# EasyEDA schematic Schematic_63S8_(V1.5)_2026-08-04.json
TITLE: 53S8 Hexadecimal Keypad; REV: 1.5; Sheet: 1/1; Drawn By: Rumidom
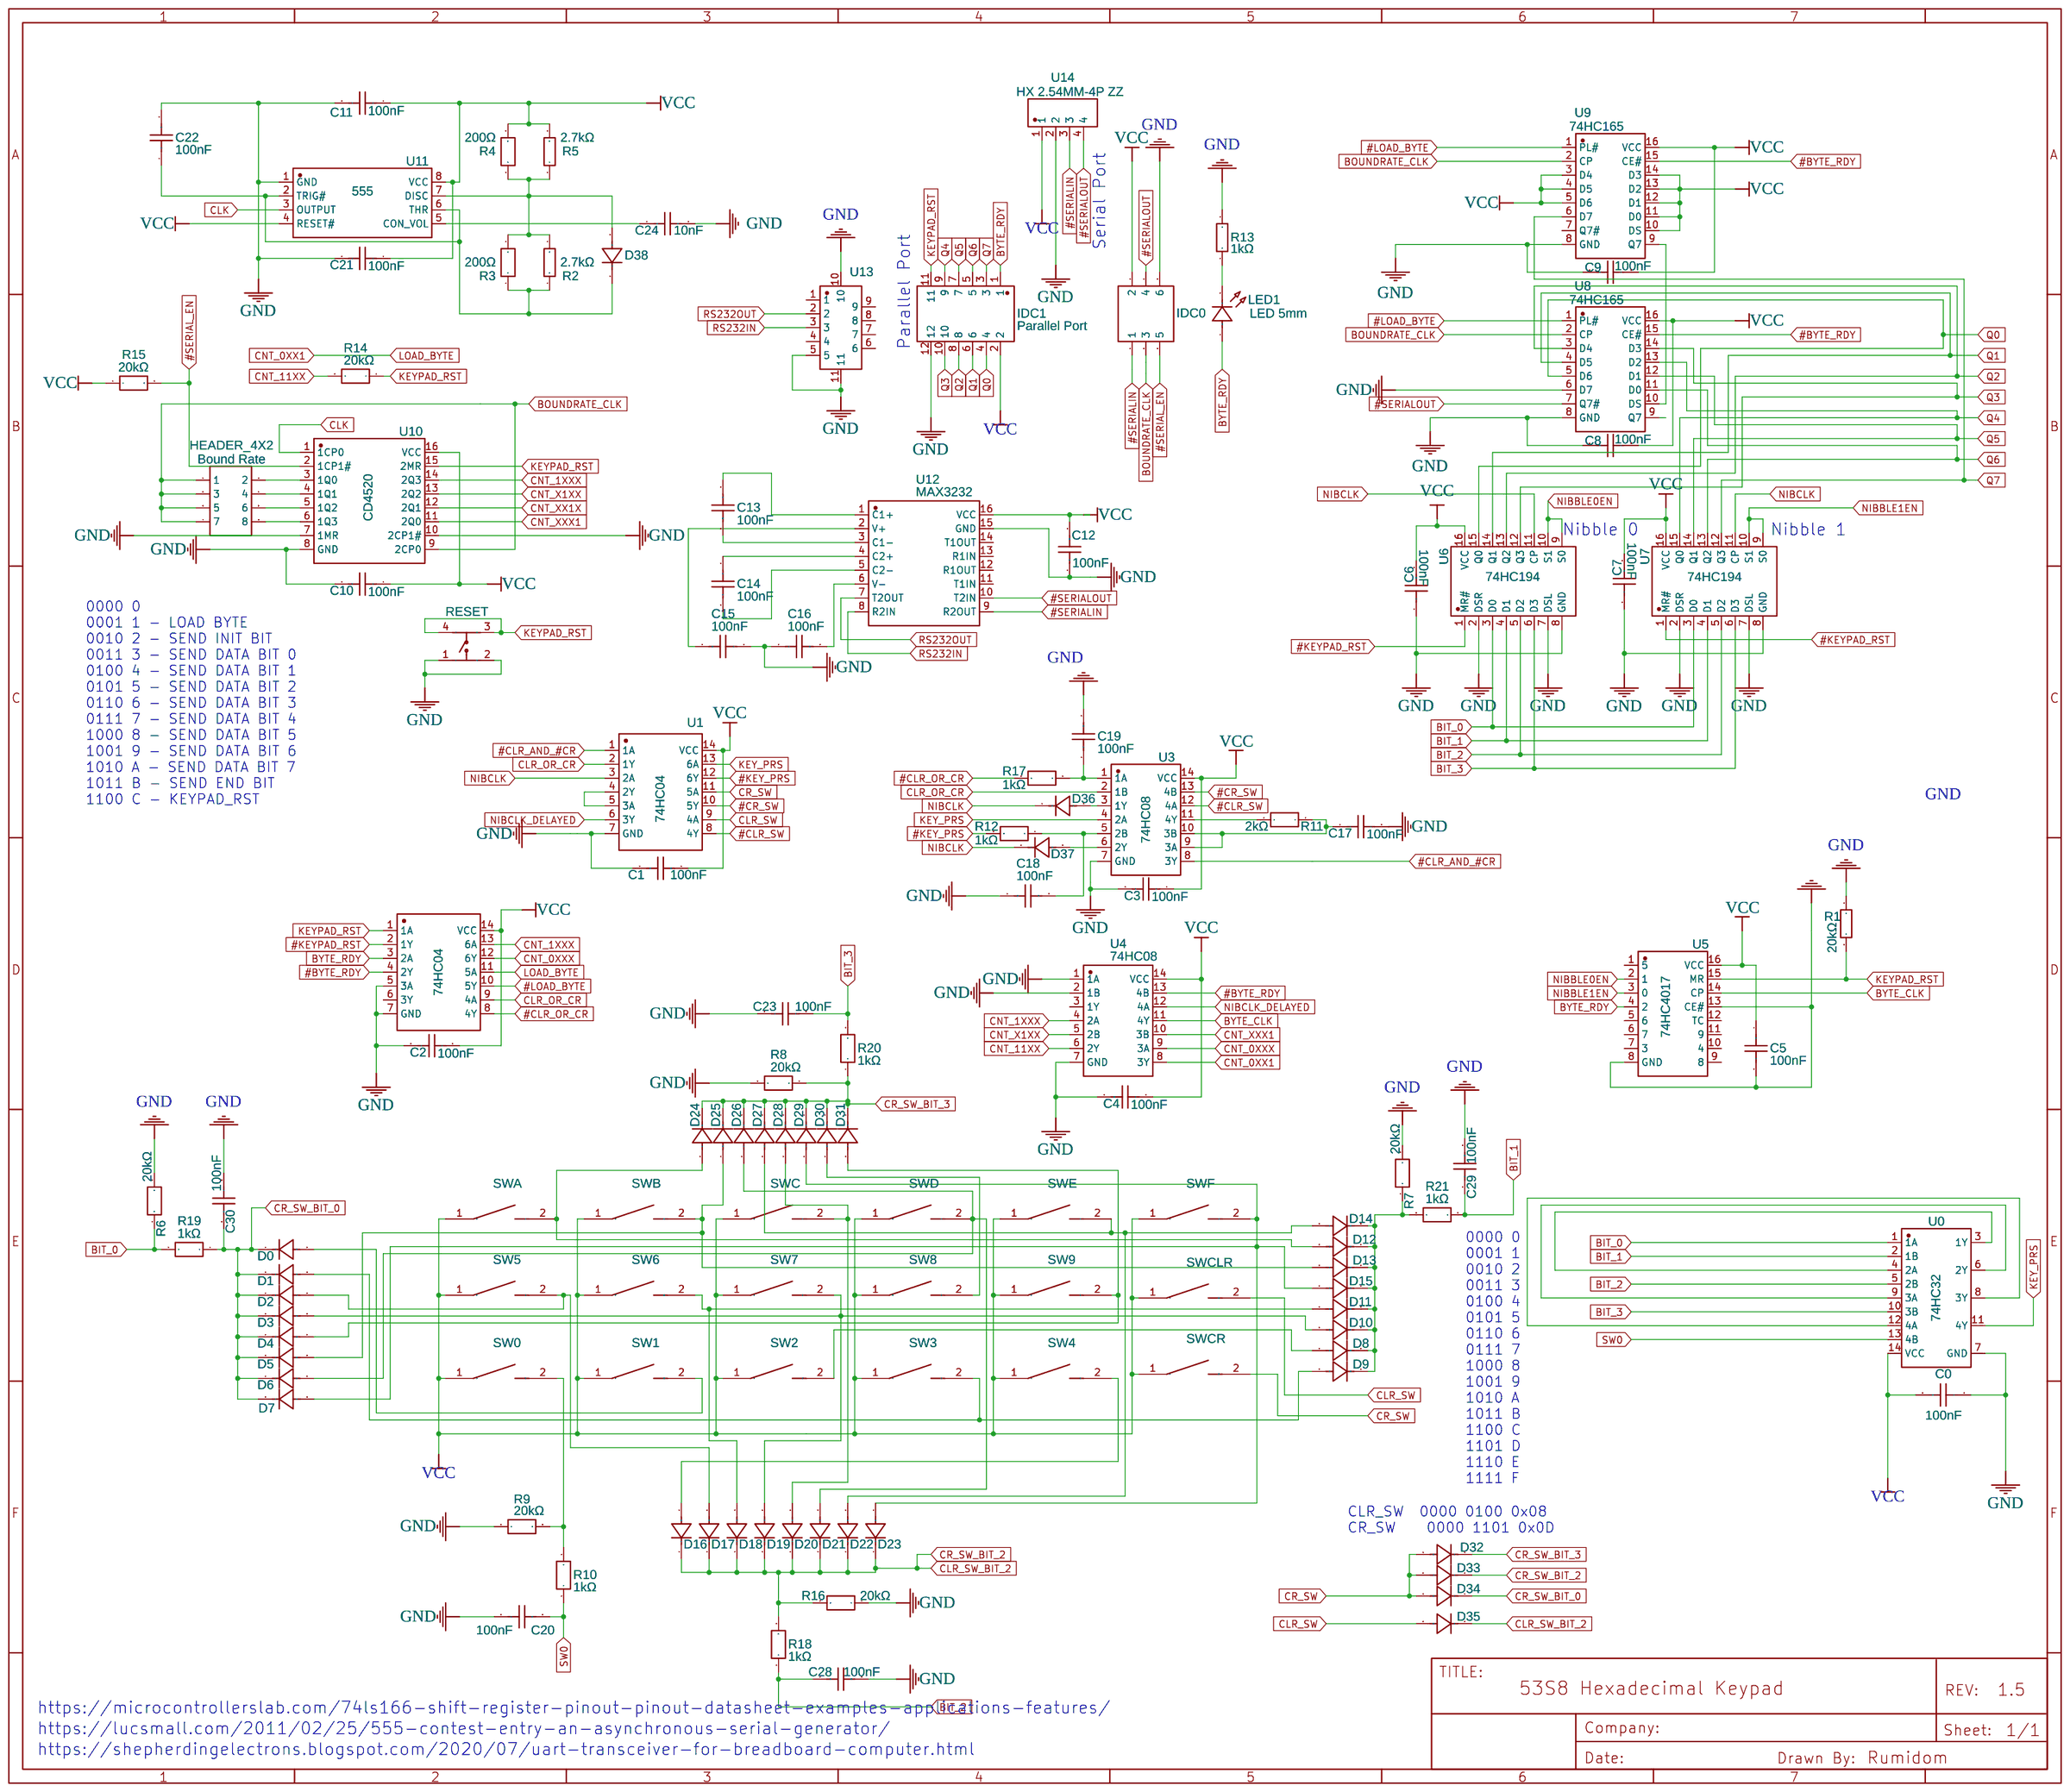
[diagram p0: schematic sheet]

## Parts
C0  100nF  [C0603]
C1  100nF  [C0603]
C2  100nF  [C0603]
C3  100nF  [C0603]
C4  100nF  [C0603]
C5  100nF  [C0603]
C6  100nF  [C0603]
C7  100nF  [C0603]
C8  100nF  [C0603]
C9  100nF  [C0603]
C10  100nF  [C0603]
C11  100nF  [C0603]
C12  100nF  [C0603]
C13  100nF  [C0603]
C14  100nF  [C0603]
C15  100nF  [C0603]
C16  100nF  [C0603]
C17  100nF  [C0603]
C18  100nF  [C0603]
C19  100nF  [C0603]
C20  100nF  [C0603]
C21  100nF  [C0603]
C22  100nF  [C0603]
C23  100nF  [C0603]
C24  10nF  [C0603]
C28  100nF  [C0603]
C29  100nF  [C0603]
C30  100nF  [C0603]
D0  JAN1N4148UR-1  [DO-213AA_L3.5-W1.5-RD]
D1  JAN1N4148UR-1  [DO-213AA_L3.5-W1.5-RD]
D2  JAN1N4148UR-1  [DO-213AA_L3.5-W1.5-RD]
D3  JAN1N4148UR-1  [DO-213AA_L3.5-W1.5-RD]
D4  JAN1N4148UR-1  [DO-213AA_L3.5-W1.5-RD]
D5  JAN1N4148UR-1  [DO-213AA_L3.5-W1.5-RD]
D6  JAN1N4148UR-1  [DO-213AA_L3.5-W1.5-RD]
D7  JAN1N4148UR-1  [DO-213AA_L3.5-W1.5-RD]
D8  JAN1N4148UR-1  [DO-213AA_L3.5-W1.5-RD]
D9  JAN1N4148UR-1  [DO-213AA_L3.5-W1.5-RD]
D10  JAN1N4148UR-1  [DO-213AA_L3.5-W1.5-RD]
D11  JAN1N4148UR-1  [DO-213AA_L3.5-W1.5-RD]
D12  JAN1N4148UR-1  [DO-213AA_L3.5-W1.5-RD]
D13  JAN1N4148UR-1  [DO-213AA_L3.5-W1.5-RD]
D14  JAN1N4148UR-1  [DO-213AA_L3.5-W1.5-RD]
D15  JAN1N4148UR-1  [DO-213AA_L3.5-W1.5-RD]
D16  JAN1N4148UR-1  [DO-213AA_L3.5-W1.5-RD]
D17  JAN1N4148UR-1  [DO-213AA_L3.5-W1.5-RD]
D18  JAN1N4148UR-1  [DO-213AA_L3.5-W1.5-RD]
D19  JAN1N4148UR-1  [DO-213AA_L3.5-W1.5-RD]
D20  JAN1N4148UR-1  [DO-213AA_L3.5-W1.5-RD]
D21  JAN1N4148UR-1  [DO-213AA_L3.5-W1.5-RD]
D22  JAN1N4148UR-1  [DO-213AA_L3.5-W1.5-RD]
D23  JAN1N4148UR-1  [DO-213AA_L3.5-W1.5-RD]
D24  JAN1N4148UR-1  [DO-213AA_L3.5-W1.5-RD]
D25  JAN1N4148UR-1  [DO-213AA_L3.5-W1.5-RD]
D26  JAN1N4148UR-1  [DO-213AA_L3.5-W1.5-RD]
D27  JAN1N4148UR-1  [DO-213AA_L3.5-W1.5-RD]
D28  JAN1N4148UR-1  [DO-213AA_L3.5-W1.5-RD]
D29  JAN1N4148UR-1  [DO-213AA_L3.5-W1.5-RD]
D30  JAN1N4148UR-1  [DO-213AA_L3.5-W1.5-RD]
D31  JAN1N4148UR-1  [DO-213AA_L3.5-W1.5-RD]
D32  JAN1N4148UR-1  [DO-213AA_L3.5-W1.5-RD]
D33  JAN1N4148UR-1  [DO-213AA_L3.5-W1.5-RD]
D34  JAN1N4148UR-1  [DO-213AA_L3.5-W1.5-RD]
D35  JAN1N4148UR-1  [DO-213AA_L3.5-W1.5-RD]
D36  JAN1N4148UR-1  [DO-213AA_L3.5-W1.5-RD]
D37  JAN1N4148UR-1  [DO-213AA_L3.5-W1.5-RD]
D38  JAN1N4148UR-1  [DO-213AA_L3.5-W1.5-RD]
HEADER_4X2  Bound Rate  [HEADER 4X2]
IDC0  Serial Port  [IDC-TH_6P-P2.54_C11214]
IDC1  Parallel Port  [IDC-TH_12P-P2.54-V-M-R2-C6-LS2.54]
LED1  LED 5mm  [LED-5MM-5MM]
R1  20kΩ  [R0603]
R2  2.7kΩ  [R0603]
R3  200Ω  [R0603]
R4  200Ω  [R0603]
R5  2.7kΩ  [R0603]
R6  20kΩ  [R0603]
R7  20kΩ  [R0603]
R8  20kΩ  [R0603]
R9  20kΩ  [R0603]
R10  1kΩ  [R0603]
R11  2kΩ  [R0603]
R12  1kΩ  [R0603]
R13  1kΩ  [R0603]
R14  20kΩ  [R0603]
R15  20kΩ  [R0603]
R16  20kΩ  [R0603]
R17  1kΩ  [R0603]
R18  1kΩ  [R0603]
R19  1kΩ  [R0603]
R20  1kΩ  [R0603]
R21  1kΩ  [R0603]
RESET  button6*6*8  [KEY-TH_4P-L6.0-W6.0-P4.50-LS7.5]
SW0  Cherry_SW  [CHERRY MX]
SW1  Cherry_SW  [CHERRY MX]
SW2  Cherry_SW  [CHERRY MX]
SW3  Cherry_SW  [CHERRY MX]
SW4  Cherry_SW  [CHERRY MX]
SW5  Cherry_SW  [CHERRY MX]
SW6  Cherry_SW  [CHERRY MX]
SW7  Cherry_SW  [CHERRY MX]
SW8  Cherry_SW  [CHERRY MX]
SW9  Cherry_SW  [CHERRY MX]
SWA  Cherry_SW  [CHERRY MX]
SWB  Cherry_SW  [CHERRY MX]
SWC  Cherry_SW  [CHERRY MX]
SWCLR  Cherry_SW  [CHERRY MX]
SWCR  Cherry_SW  [CHERRY MX]
SWD  Cherry_SW  [CHERRY MX]
SWE  Cherry_SW  [CHERRY MX]
SWF  Cherry_SW  [CHERRY MX]
U0  74HC32  [SOIC-16_L10.8-W4.5-P1.27-LS6.8-BL]
U1  74HC04  [SOIC-16_L10.8-W4.5-P1.27-LS6.8-BL]
U2  74HC04  [SOIC-16_L10.8-W4.5-P1.27-LS6.8-BL]
U3  74HC08  [SOIC-16_L10.8-W4.5-P1.27-LS6.8-BL]
U4  74HC08  [SOIC-16_L10.8-W4.5-P1.27-LS6.8-BL]
U5  74HC4017  [SOIC-16_L10.8-W4.5-P1.27-LS6.8-BL]
U6  74HC194  [SOIC-16_L10.8-W4.5-P1.27-LS6.8-BL]
U7  74HC194  [SOIC-16_L10.8-W4.5-P1.27-LS6.8-BL]
U8  74HC165  [SOP-16_L9.9-W3.9-P1.27-LS6.1-BL]
U9  74HC165  [SOP-16_L9.9-W3.9-P1.27-LS6.1-BL]
U10  CD4520  [SOIC-16_L10.8-W4.5-P1.27-LS6.8-BL]
U11  555  [SOP-8_L4.9-W3.8-P1.27-LS6.0-BL]
U12  MAX3232  [SOIC-16_L10.8-W4.5-P1.27-LS6.8-BL]
U13  DB9 RS232  [DB9-TH_DB9FEMALE_C9900003585]
U14  HX 2.54MM-4P ZZ  [CONN-TH_4P-P2.50_HX-2.54MM-4P-ZZ-MS]

## Library data of the parts
C0-C21 C23 C28-C30 = GRM188R72A104KA35J_C3011705: Supplier: LCSC; Supplier Part: C3011705; Manufacturer: muRata(村田); Manufacturer Part: GRM188R72A104KA35J; JLCPCB Part Class: Extended Part; Contributor: lcsc
C22 C24 = C1608X7R1H103K/10: Supplier: LCSC; Supplier Part: C19340180; Manufacturer: TDK; JLCPCB Part Class: Extended Part; Contributor: lcsc
D0-D38 = JAN1N4148UR-1: Supplier: LCSC; Supplier Part: C2831794; Manufacturer: MICROCHIP(美国微芯); JLCPCB Part Class: Extended Part; Contributor: lcsc
HEADER_4X2 = HEADER_4x2: Contributor: i3dbee
IDC0 = HDR-IDC-2.54-2X3P: Supplier: LCSC; Manufacturer: BOOMELE(博穆精密); Manufacturer Part: 2.54-2*3P简牛; Supplier Part: C11214; JLCPCB Part Class: Extended Part
IDC1 = BH254V-12P: Supplier: LCSC; Supplier Part: C48687626; Manufacturer: XFCN(兴飞); JLCPCB Part Class: Extended Part; Contributor: lcsc
LED1 = LED 5mm: Supplier: LCSC; Supplier Part: C605466; Manufacturer: Everlight Elec; Manufacturer Part: 264-7ID; Contributor: ahmad_agus; JLCPCB Part Class: Extended Part
R1 = ARG03BTC2002: Contributor: LCSC; Supplier: LCSC; Supplier Part: C335084; Manufacturer: Viking(光颉); JLCPCB Part Class: Extended Part
R2 R5 = RMC06032.7K1%N: Contributor: LCSC; Supplier: LCSC; Supplier Part: C325595; Manufacturer: Tyohm(幸亚电阻); JLCPCB Part Class: Extended Part
R3 R4 = CRCW0603200RFKEAHP: Supplier: LCSC; Supplier Part: C313701; Manufacturer: VISHAY(威世); JLCPCB Part Class: Extended Part; Contributor: lcsc
R6-R9 R11 R12 R14-R17 = AT0603BRE0720KL: Supplier: LCSC; Supplier Part: C6126568; Manufacturer: YAGEO(国巨); JLCPCB Part Class: Extended Part; Contributor: lcsc
R10 R18-R21 = 0603 ±5% 1K: Contributor: LCSC; Supplier: LCSC; Supplier Part: C2889391; Manufacturer: VO(翔胜); JLCPCB Part Class: Extended Part
R13 = 0603WAF1001T5E: Supplier: LCSC; Manufacturer: UNI-ROYAL(厚声); Supplier Part: C21190; JLCPCB Part Class: Basic Part
RESET = button6*6*8: Supplier Part: C59982; Supplier: LCSC; Manufacturer: ReliaPro; JLCPCB Part Class: Extended Part
SW0-SW9 SWA SWB SWC SWCLR SWCR SWD SWE SWF = CHERRY_MX Clone: Manufacturer Part: CHERRY; Contributor: drummdan; Supplier: Reichelt
U0 = 74HCT32D/C118: Supplier: LCSC; Supplier Part: C4470225; Manufacturer: Nexperia(安世); JLCPCB Part Class: Extended Part; Contributor: lcsc
U1 U2 = 74HC04: Supplier: LCSC; Manufacturer: FM(富满); Manufacturer Part: 74HC04D; Supplier Part: C86613; JLCPCB Part Class: Extended Part
U3 U4 = 74HC08D-HX: Supplier: LCSC; Supplier Part: C54784392; Manufacturer: ZHHXDZ(海芯电子); Contributor: lcsc; JLCPCB Part Class: Extended Part
U5 = CD74HC4017MT: Contributor: LCSC; Supplier: LCSC; Supplier Part: C2675446; Manufacturer: TI(德州仪器); JLCPCB Part Class: Extended Part
U6 U7 = CD74HC194M: Contributor: lcsc; Supplier: LCSC; Supplier Part: C3304354; Manufacturer: TI(德州仪器); JLCPCB Part Class: Extended Part
U8 U9 = EM74HC165D: Supplier: LCSC; Supplier Part: C49188286; Manufacturer: EnergyMath(芯祥科技); Contributor: lcsc; JLCPCB Part Class: Extended Part
U10 = 74HC4520D,112: Contributor: LCSC; Supplier: LCSC; Supplier Part: C547069; Manufacturer: Nexperia(安世); JLCPCB Part Class: Extended Part
U11 = LMC555DRG: Supplier: LCSC; Supplier Part: C19723742; Manufacturer: HGC(深圳汉芯); JLCPCB Part Class: Extended Part; Contributor: lcsc
U12 = COSMAX3232ID: Supplier: LCSC; Supplier Part: C18198088; Manufacturer: COSINE(科山芯创); Contributor: lcsc; JLCPCB Part Class: Extended Part
U13 = 2301843-1: Contributor: lcsc; Supplier: LCSC; Supplier Part: C3118153; Manufacturer: TE Connectivity(泰科电子); JLCPCB Part Class: Extended Part
U14 = HX 2.54MM-4P ZZ: Supplier: LCSC; Supplier Part: C7543433; Manufacturer: hanxia(韩下); Manufacturer Part: HX 2.54mm-4P ZZ; Contributor: lcsc; JLCPCB Part Class: Extended Part

## Nets
GND: C0.1 C1.2 C2.2 C3.2 C4.2 C5.2 C6.1 C7.1 C8.2 C9.2 C10.2 C11.2 C12.2 C15.2 C16.1 C17.2 C18.1 C19.2 C20.1 C21.2 C22.2 C23.1 C24.2 C28.2 C29.2 C30.1 IDC0.6 IDC1.12 R1.1 R6.2 R7.2 R8.2 R9.1 R13.2 R16.1 RESET.1 RESET.2 U0.7(GND) U1.7(GND) U2.5(3A) U2.7(GND) U3.7(GND) U4.1(1A) U4.2(1B) U4.7(GND) U5.8(GND) U5.13(CE#) U6.2(DSR) U6.7(DSL) U6.8(GND) U7.2(DSR) U7.7(DSL) U7.8(GND) U8.6(D7) U8.8(GND) U9.8(GND) U10.7(1MR) U10.8(GND) U10.10(2CP1#) U11.1(GND) U12.15(GND) U13.5 U13.10 U13.11 U14.2
VCC: C0.2 C1.1 C2.1 C3.1 C4.1 C5.1 C6.2 C7.2 C8.1 C9.1 C10.1 C11.1 C12.1 C21.1 IDC0.2 IDC1.2 R4.2 R5.2 R15.1 SW0.1 SW1.1 SW2.1 SW3.1 SW4.1 SW5.1 SW6.1 SW7.1 SW8.1 SW9.1 SWA.1 SWB.1 SWC.1 SWCLR.1 SWCR.1 SWD.1 SWE.1 SWF.1 U0.14(VCC) U1.14(VCC) U2.14(VCC) U3.14(VCC) U4.14(VCC) U5.16(VCC) U6.16(VCC) U7.16(VCC) U8.16(VCC) U9.3(D4) U9.4(D5) U9.5(D6) U9.10(DS) U9.11(D0) U9.12(D1) U9.13(D2) U9.14(D3) U9.16(VCC) U10.16(VCC) U11.4(RESET#) U11.8(VCC) U12.16(VCC) U14.1
#BYTE_RDY: U2.4(2Y) U4.13(4B) U8.15(CE#) U9.15(CE#)
#CLR_AND_#CR: U1.1(1A) U3.8(3Y)
#CLR_OR_CR: R17.2 U2.8(4Y)
#CLR_SW: U1.8(4Y) U3.12(4A)
#CR_SW: U1.10(5Y) U3.13(4B)
#KEY_PRS: R12.2 U1.12(6Y)
#KEYPAD_RST: U2.2(1Y) U6.1(MR#) U7.1(MR#)
#LOAD_BYTE: U2.10(5Y) U8.1(PL#) U9.1(PL#)
#SERIAL_EN: IDC0.5 R15.2 U10.2(1CP1#)
#SERIALIN: IDC0.1 U12.9(R2OUT) U14.3
#SERIALOUT: IDC0.4 U8.7(Q7#) U12.10(T2IN) U14.4
BIT_0: R6.1 R19.2 U0.1(1A) U6.3(D0) U7.3(D0)
BIT_1: C29.1 R21.1 U0.2(1B) U6.4(D1) U7.4(D1)
BIT_2: C28.1 R18.1 U0.5(2B) U6.5(D2) U7.5(D2)
BIT_3: C23.2 R20.2 U0.10(3B) U6.6(D3) U7.6(D3)
BOUNDRATE_CLK: HEADER_4X2.1 HEADER_4X2.3 HEADER_4X2.5 HEADER_4X2.7 IDC0.3 U8.2(CP) U9.2(CP) U10.9(2CP0)
BYTE_CLK: U4.11(4Y) U5.14(CP)
BYTE_RDY: IDC1.1 LED1.1(A) U2.3(2A) U5.4(2)
CLK: U10.1(1CP0) U11.3(OUTPUT)
CLR_OR_CR: U1.2(1Y) U2.9(4A) U3.2(1B)
CLR_SW: D35.2(A) SWCLR.2 U1.9(4A)
CLR_SW_BIT_2: D16.1(K) D17.1(K) D18.1(K) D19.1(K) D20.1(K) D21.1(K) D22.1(K) D23.1(K) D33.1(K) D35.1(K) R16.2 R18.2
CNT_0XX1: U2.11(5A) U4.8(3Y)
CNT_0XXX: U2.12(6Y) U4.9(3A)
CNT_1XXX: U2.13(6A) U4.4(2A) U10.14(2Q3)
CNT_11XX: R14.2 U4.6(2Y)
CNT_X1XX: U4.5(2B) U10.13(2Q2)
CNT_XX1X: U10.12(2Q1)
CNT_XXX1: U4.10(3B) U10.11(2Q0)
CR_SW: D32.2(A) D33.2(A) D34.2(A) SWCR.2 U1.11(5A)
CR_SW_BIT_0: C30.2 D0.1(K) D1.1(K) D2.1(K) D3.1(K) D4.1(K) D5.1(K) D6.1(K) D7.1(K) D34.1(K) R19.1
CR_SW_BIT_3: D24.1(K) D25.1(K) D26.1(K) D27.1(K) D28.1(K) D29.1(K) D30.1(K) D31.1(K) D32.1(K) R8.1 R20.1
KEY_PRS: U0.11(4Y) U1.13(6A) U3.4(2A)
KEYPAD_RST: IDC1.11 R1.2 R14.1 RESET.3 RESET.4 U2.1(1A) U5.15(MR) U10.15(2MR)
NIBBLE0EN: U5.2(1) U6.9(S0) U6.10(S1)
NIBBLE1EN: U5.3(0) U7.9(S0) U7.10(S1)
NIBCLK: D36.1(K) D37.1(K) U1.3(2A) U6.11(CP) U7.11(CP)
NIBCLK_DELAYED: U1.6(3Y) U4.12(4A)
Q0: IDC1.4 U6.15(Q0) U8.5(D6)
Q1: IDC1.6 U6.14(Q1) U8.4(D5)
Q2: IDC1.8 U6.13(Q2) U8.3(D4)
Q3: IDC1.10 U6.12(Q3) U8.14(D3)
Q4: IDC1.9 U7.15(Q0) U8.13(D2)
Q5: IDC1.7 U7.14(Q1) U8.12(D1)
Q6: IDC1.5 U7.13(Q2) U8.11(D0)
Q7: IDC1.3 U7.12(Q3) U9.6(D7)
RS232IN: U12.8(R2IN) U13.3
RS232OUT: U12.7(T2OUT) U13.2
SW0: C20.2 R10.1 U0.13(4B)
Net-(C13-1): C13.1 U12.1(C1+)
Net-(C13-2): C13.2 U12.3(C1-)
Net-(C14-1): C14.1 U12.4(C2+)
Net-(C14-2): C14.2 U12.5(C2-)
Net-(C15-1): C15.1 U12.2(V+)
Net-(C16-2): C16.2 U12.6(V-)
Net-(C17-1): C17.1 R11.1 U3.9(3A) U3.10(3B)
Net-(C18-2): C18.2 R12.1 U3.5(2B)
Net-(C19-1): C19.1 R17.1 U3.1(1A)
Net-(C22-1): C22.1 D38.1(K) R2.1 R3.1 U11.2(TRIG#) U11.6(THR)
Net-(C24-1): C24.1 U11.5(CON_VOL)
Net-(D0-2): D0.2(A) SW1.2
Net-(D1-2): D1.2(A) D9.2(A) SW3.2
Net-(D2-2): D2.2(A) D17.2(A) SW5.2
Net-(D3-2): D3.2(A) D10.2(A) D19.2(A) SW7.2
Net-(D4-2): D4.2(A) D31.2(A) SW9.2
Net-(D5-2): D5.2(A) D13.2(A) D25.2(A) SWB.2
Net-(D6-2): D6.2(A) D21.2(A) D26.2(A) SWD.2
Net-(D7-2): D7.2(A) D15.2(A) D23.2(A) D29.2(A) SWF.2
Net-(D8-1): D8.1(K) D9.1(K) D10.1(K) D11.1(K) D12.1(K) D13.1(K) D14.1(K) D15.1(K) R7.1 R21.2
Net-(D8-2): D8.2(A) SW2.2
Net-(D11-2): D11.2(A) D18.2(A) SW6.2
Net-(D12-2): D12.2(A) D24.2(A) SWA.2
Net-(D14-2): D14.2(A) D22.2(A) D27.2(A) SWE.2
Net-(D16-2): D16.2(A) SW4.2
Net-(D20-2): D20.2(A) D28.2(A) SWC.2
Net-(D30-2): D30.2(A) SW8.2
Net-(D36-2): D36.2(A) U3.3(1Y)
Net-(D37-2): D37.2(A) U3.6(2Y)
Net-(D38-2): D38.2(A) R2.2 R3.2 U11.7(DISC)
Net-(HEADER_4X2-2): HEADER_4X2.2 U10.3(1Q0)
Net-(HEADER_4X2-4): HEADER_4X2.4 U10.4(1Q1)
Net-(HEADER_4X2-6): HEADER_4X2.6 U10.5(1Q2)
Net-(HEADER_4X2-8): HEADER_4X2.8 U10.6(1Q3)
Net-(LED1-2): LED1.2(K) R13.1
Net-(R4-1): R4.1 R5.1
Net-(R9-2): R9.2 R10.2 SW0.2
Net-(R11-2): R11.2 U3.11(4Y)
Net-(U0-3): U0.3(1Y) U0.4(2A)
Net-(U0-6): U0.6(2Y) U0.9(3A)
Net-(U0-8): U0.8(3Y) U0.12(4A)
Net-(U1-4): U1.4(2Y) U1.5(3A)
Net-(U8-10): U8.10(DS) U9.9(Q7)

Not connected (* = marked no-connect by the designer): U2 6(3Y); U4 3(1Y); U5 1(5) 5(6) 6(7) 7(3) 9(8) 10(4) 11(9) 12(TC); U8 9(Q7); U9 7(Q7#); U12 11(T1IN) 12(R1OUT) 13(R1IN) 14(T1OUT); U13 1 4 6 7 8 9

## Notes on the sheet
- Serial Port
- Parallel Port
- Nibble 0
- Nibble 1
- 0000 0
  0001 1 - LOAD BYTE
  0010 2 - SEND INIT BIT
  0011 3 - SEND DATA BIT 0
  0100 4 - SEND DATA BIT 1
  0101 5 - SEND DATA BIT 2
  0110 6 - SEND DATA BIT 3
  0111 7 - SEND DATA BIT 4
  1000 8 - SEND DATA BIT 5
  1001 9 - SEND DATA BIT 6
  1010 A - SEND DATA BIT 7
  1011 B - SEND END BIT
  1100 C - KEYPAD_RST
- 0000 0
  0001 1
  0010 2
  0011 3
  0100 4
  0101 5
  0110 6
  0111 7
  1000 8
  1001 9
  1010 A
  1011 B
  1100 C
  1101 D
  1110 E
  1111 F
- CLR_SW  0000 0100 0x08
  CR_SW    0000 1101 0x0D
- https://microcontrollerslab.com/74ls166-shift-register-pinout-pinout-datasheet-examples-applications-features/
- https://lucsmall.com/2011/02/25/555-contest-entry-an-asynchronous-serial-generator/
- https://shepherdingelectrons.blogspot.com/2020/07/uart-transceiver-for-breadboard-computer.html
